# Altium schematic sheet 01_detection_counter.SchDoc
size A3; SheetNumber: 3; SheetTotal: 17
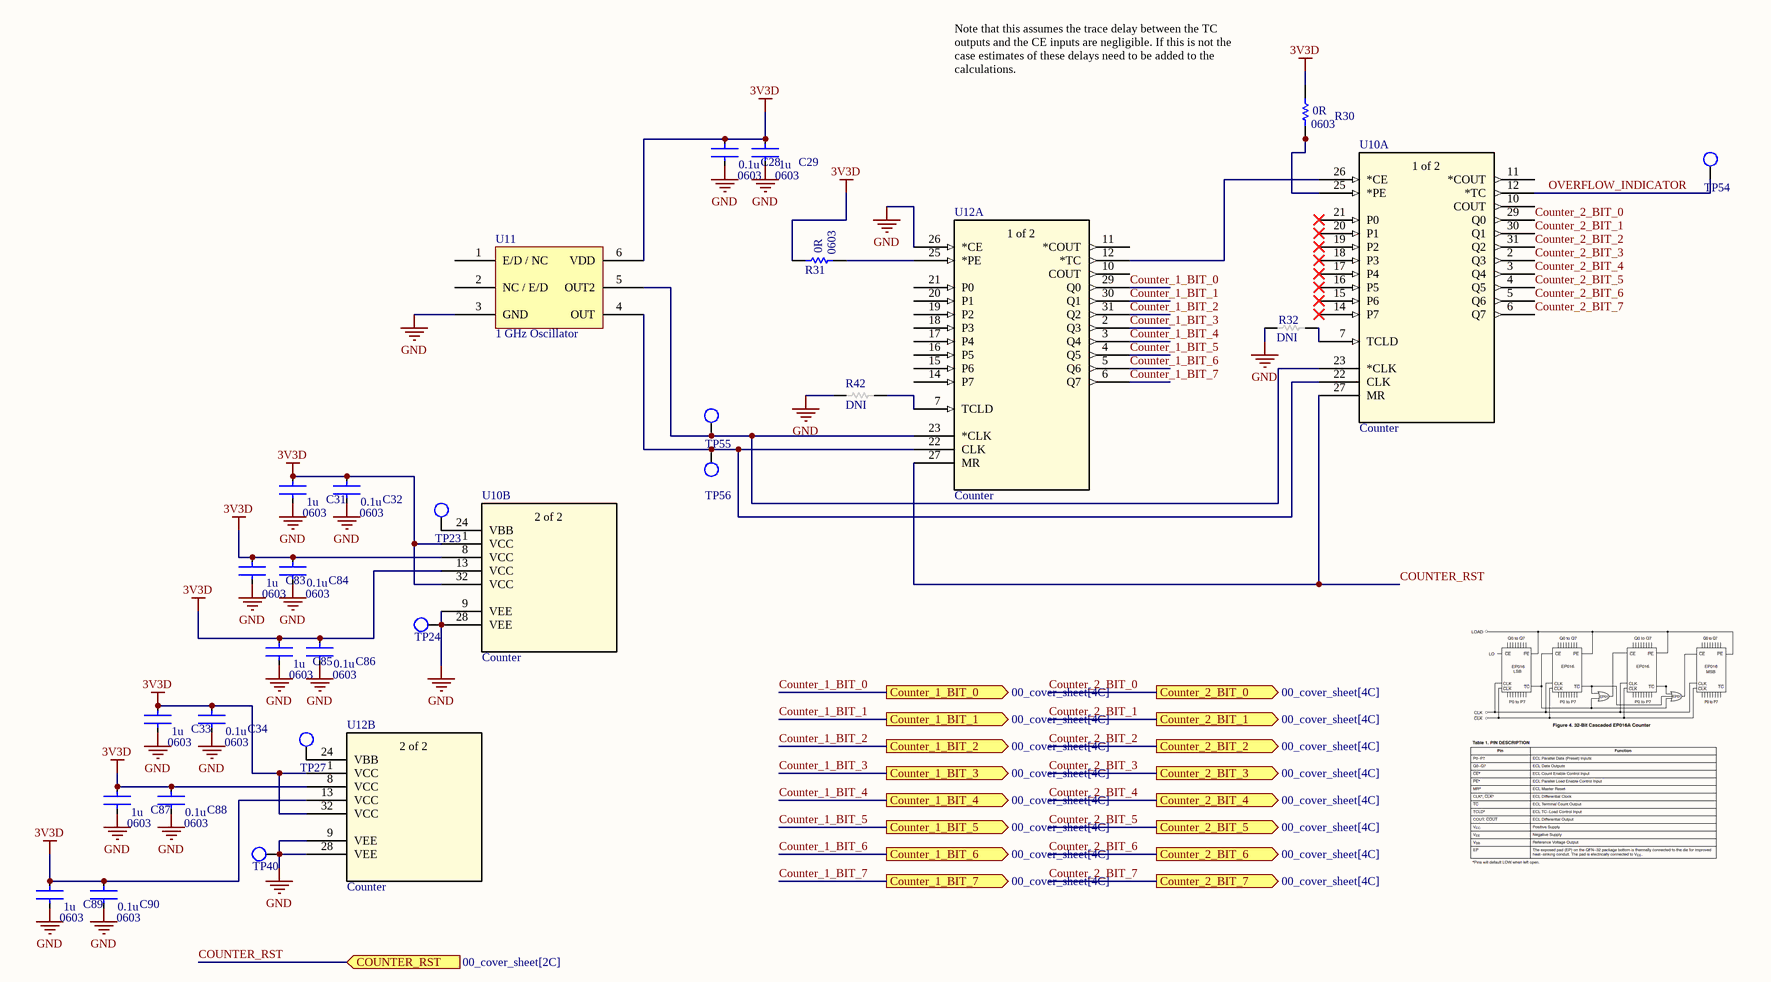
[diagram p0: 01_detection_counter.SchDoc]

## Parts
C28  CGA3E2X7R1H104K080AA  [CAPTDK0603]  (value not drawn)
C29  C1608X5R1E105K080AC  [CAPTDK0603]  (value not drawn)
C31  C1608X5R1E105K080AC  [CAPTDK0603]  (value not drawn)
C32  CGA3E2X7R1H104K080AA  [CAPTDK0603]  (value not drawn)
C33  C1608X5R1E105K080AC  [CAPTDK0603]  (value not drawn)
C34  CGA3E2X7R1H104K080AA  [CAPTDK0603]  (value not drawn)
C83  C1608X5R1E105K080AC  [CAPTDK0603]  (value not drawn)
C84  CGA3E2X7R1H104K080AA  [CAPTDK0603]  (value not drawn)
C85  C1608X5R1E105K080AC  [CAPTDK0603]  (value not drawn)
C86  CGA3E2X7R1H104K080AA  [CAPTDK0603]  (value not drawn)
C87  C1608X5R1E105K080AC  [CAPTDK0603]  (value not drawn)
C88  CGA3E2X7R1H104K080AA  [CAPTDK0603]  (value not drawn)
C89  C1608X5R1E105K080AC  [CAPTDK0603]  (value not drawn)
C90  CGA3E2X7R1H104K080AA  [CAPTDK0603]  (value not drawn)
R30  RMCF0603ZT0R00  [RES-STACK-POLE-0603]  (value not drawn)
R31  RMCF0603ZT0R00  [RES-STACK-POLE-0603]  (value not drawn)
R32  DNI  [RES_0603]
R42  DNI  [RES_0603]
TP23  TESTPOINT_S  [TESTPOINT_S]  (value not drawn)  (no BOM)
TP24  TESTPOINT_S  [TESTPOINT_S]  (value not drawn)  (no BOM)
TP27  TESTPOINT_S  [TESTPOINT_S]  (value not drawn)  (no BOM)
TP40  TESTPOINT_S  [TESTPOINT_S]  (value not drawn)  (no BOM)
TP54  TESTPOINT_S  [TESTPOINT_S]  (value not drawn)  (no BOM)
TP55  TESTPOINT_S  [TESTPOINT_S]  (value not drawn)  (no BOM)
TP56  TESTPOINT_S  [TESTPOINT_S]  (value not drawn)  (no BOM)
U10  Counter  [LQFP32_7X7_ONS]  (parts A,B of 2)
U11  1 GHz Oscillator  [XLP736A00.0000001]
U12  Counter  [LQFP32_7X7_ONS]  (parts A,B of 2)

## Ports
Counter_1_BIT_0 (out, see 00_cover_sheet[4C]), Counter_1_BIT_1 (out, see 00_cover_sheet[4C]), Counter_1_BIT_2 (out, see 00_cover_sheet[4C]), Counter_1_BIT_3 (out, see 00_cover_sheet[4C]), Counter_1_BIT_4 (out, see 00_cover_sheet[4C]), Counter_1_BIT_5 (out, see 00_cover_sheet[4C]), Counter_1_BIT_6 (out, see 00_cover_sheet[4C]), Counter_1_BIT_7 (out, see 00_cover_sheet[4C]), Counter_2_BIT_0 (out, see 00_cover_sheet[4C]), Counter_2_BIT_1 (out, see 00_cover_sheet[4C]), Counter_2_BIT_2 (out, see 00_cover_sheet[4C]), Counter_2_BIT_3 (out, see 00_cover_sheet[4C]), Counter_2_BIT_4 (out, see 00_cover_sheet[4C]), Counter_2_BIT_5 (out, see 00_cover_sheet[4C]), Counter_2_BIT_6 (out, see 00_cover_sheet[4C]), Counter_2_BIT_7 (out, see 00_cover_sheet[4C]), COUNTER_RST (in, see 00_cover_sheet[2C])

## Nets
3V3D: C28.1 C29.1 C31.1 C32.1 C33.1 C34.1 C83.1 C84.1 C85.1 C86.1 C87.1 C88.1 C89.1 C90.1 R30.2 R31.2 U10.1(VCC) U10.8(VCC) U10.13(VCC) U10.32(VCC) U11.6(VDD) U12.1(VCC) U12.8(VCC) U12.13(VCC) U12.32(VCC)
GND: C28.2 C29.2 C31.2 C32.2 C33.2 C34.2 C83.2 C84.2 C85.2 C86.2 C87.2 C88.2 C89.2 C90.2 R32.1 R42.1 TP24.1 TP40.1 U10.9(VEE) U10.28(VEE) U11.3(GND) U12.9(VEE) U12.26(*CE) U12.28(VEE)
Counter_1_BIT_0: U12.29(Q0) ; port Counter_1_BIT_0
Counter_1_BIT_1: U12.30(Q1) ; port Counter_1_BIT_1
Counter_1_BIT_2: U12.31(Q2) ; port Counter_1_BIT_2
Counter_1_BIT_3: U12.2(Q3) ; port Counter_1_BIT_3
Counter_1_BIT_4: U12.3(Q4) ; port Counter_1_BIT_4
Counter_1_BIT_5: U12.4(Q5) ; port Counter_1_BIT_5
Counter_1_BIT_6: U12.5(Q6) ; port Counter_1_BIT_6
Counter_1_BIT_7: U12.6(Q7) ; port Counter_1_BIT_7
Counter_2_BIT_0: U10.29(Q0) ; port Counter_2_BIT_0
Counter_2_BIT_1: U10.30(Q1) ; port Counter_2_BIT_1
Counter_2_BIT_2: U10.31(Q2) ; port Counter_2_BIT_2
Counter_2_BIT_3: U10.2(Q3) ; port Counter_2_BIT_3
Counter_2_BIT_4: U10.3(Q4) ; port Counter_2_BIT_4
Counter_2_BIT_5: U10.4(Q5) ; port Counter_2_BIT_5
Counter_2_BIT_6: U10.5(Q6) ; port Counter_2_BIT_6
Counter_2_BIT_7: U10.6(Q7) ; port Counter_2_BIT_7
COUNTER_RST: U10.27(MR) U12.27(MR) ; port COUNTER_RST
OVERFLOW_INDICATOR: TP54.1 U10.12(*TC)
NetR30_1: R30.1 U10.25(*PE)
NetR31_1: R31.1 U12.25(*PE)
NetR32_2: R32.2 U10.7(TCLD)
NetR42_2: R42.2 U12.7(TCLD)
NetTP23_1: TP23.1 U10.24(VBB)
NetTP27_1: TP27.1 U12.24(VBB)
NetTP55_1: TP55.1 U10.23(*CLK) U11.5(OUT2) U12.23(*CLK)
NetTP56_1: TP56.1 U10.22(CLK) U11.4(OUT) U12.22(CLK)
NetU10_26: U10.26(*CE) U12.12(*TC)

Not connected (* = marked no-connect by the designer): U10 10(COUT) 11(*COUT) 14(P7)* 15(P6)* 16(P5)* 17(P4)* 18(P3)* 19(P2)* 20(P1)* 21(P0)*; U11 1(E/D_/_NC) 2(NC_/_E/D); U12 10(COUT) 11(*COUT) 14(P7) 15(P6) 16(P5) 17(P4) 18(P3) 19(P2) 20(P1) 21(P0)

## Notes on the sheet
- Note that this assumes the trace delay between the TC
  outputs and the CE inputs are negligible. If this is not the
  case estimates of these delays need to be added to the
  calculations.
- (in symbol C1608X5R1E105K080AC) 1u; 0603
- (in symbol CGA3E2X7R1H104K080AA) 0.1u; 0603
- (in symbol MC100EP016AFAG, part A) 1 of 2
- (in symbol MC100EP016AFAG, part B) 2 of 2
- (in symbol RMCF0603ZT0R00) 0R; 0603

## Library data of the parts
C28 C32 C34 C84 C86 C88 C90 = CGA3E2X7R1H104K080AA: CAP CER 0.1UF 50V X7R 0603; Supplier 1: Digi-Key; Supplier Part Number 1: 445-5666-1-ND
C29 C31 C33 C83 C85 C87 C89 = C1608X5R1E105K080AC: CAP CER 1UF 25V X5R 0603; Supplier 1: Digi-Key; Supplier Part Number 1: 445-5146-1-ND
R30 R31 = RMCF0603ZT0R00: RES 0 OHM JUMPER 1/10W 0603; Supplier 1: Digi-Key; Supplier Part Number 1: RMCF0603ZT0R00CT-ND
R32 R42 = R0603: RES DNI 0603
TP23 TP24 TP27 TP40 TP54-TP56 = TESTPOINT_S: Testpoint Surface Pad
U10 U12 = MC100EP016AFAG: IC BINARY COUNTER 8-BIT 32LQFP; Mfr_Name: onsemi; RefDes: RefDes; Type: Type; Supplier 1: Digikey; Supplier Part Number 1: MC100EP016AFAGOS-ND
U11 = XLP736A00.000000I: 1 GHz XO (Standard) LVPECL Oscillator 3.3V Enable/Disable 6-SMD, No Lead 800-4305-ND  XLP736A00.000000I XTAL OSC XO 1.0000GHZ LVPECL SMD; Manufacturer: Renesas Electronics Corporation